# EasyEDA Pro project 无线LED.eprj

# Schematic Schematic1
Create Date: 2023-08-18; Page Name: P1; Project Name: 无线LED; Schematic Name: Schematic1; Update Date: 2023-08-18; Company: 嘉立创EDA; Page Size: A4; Version: V1.0
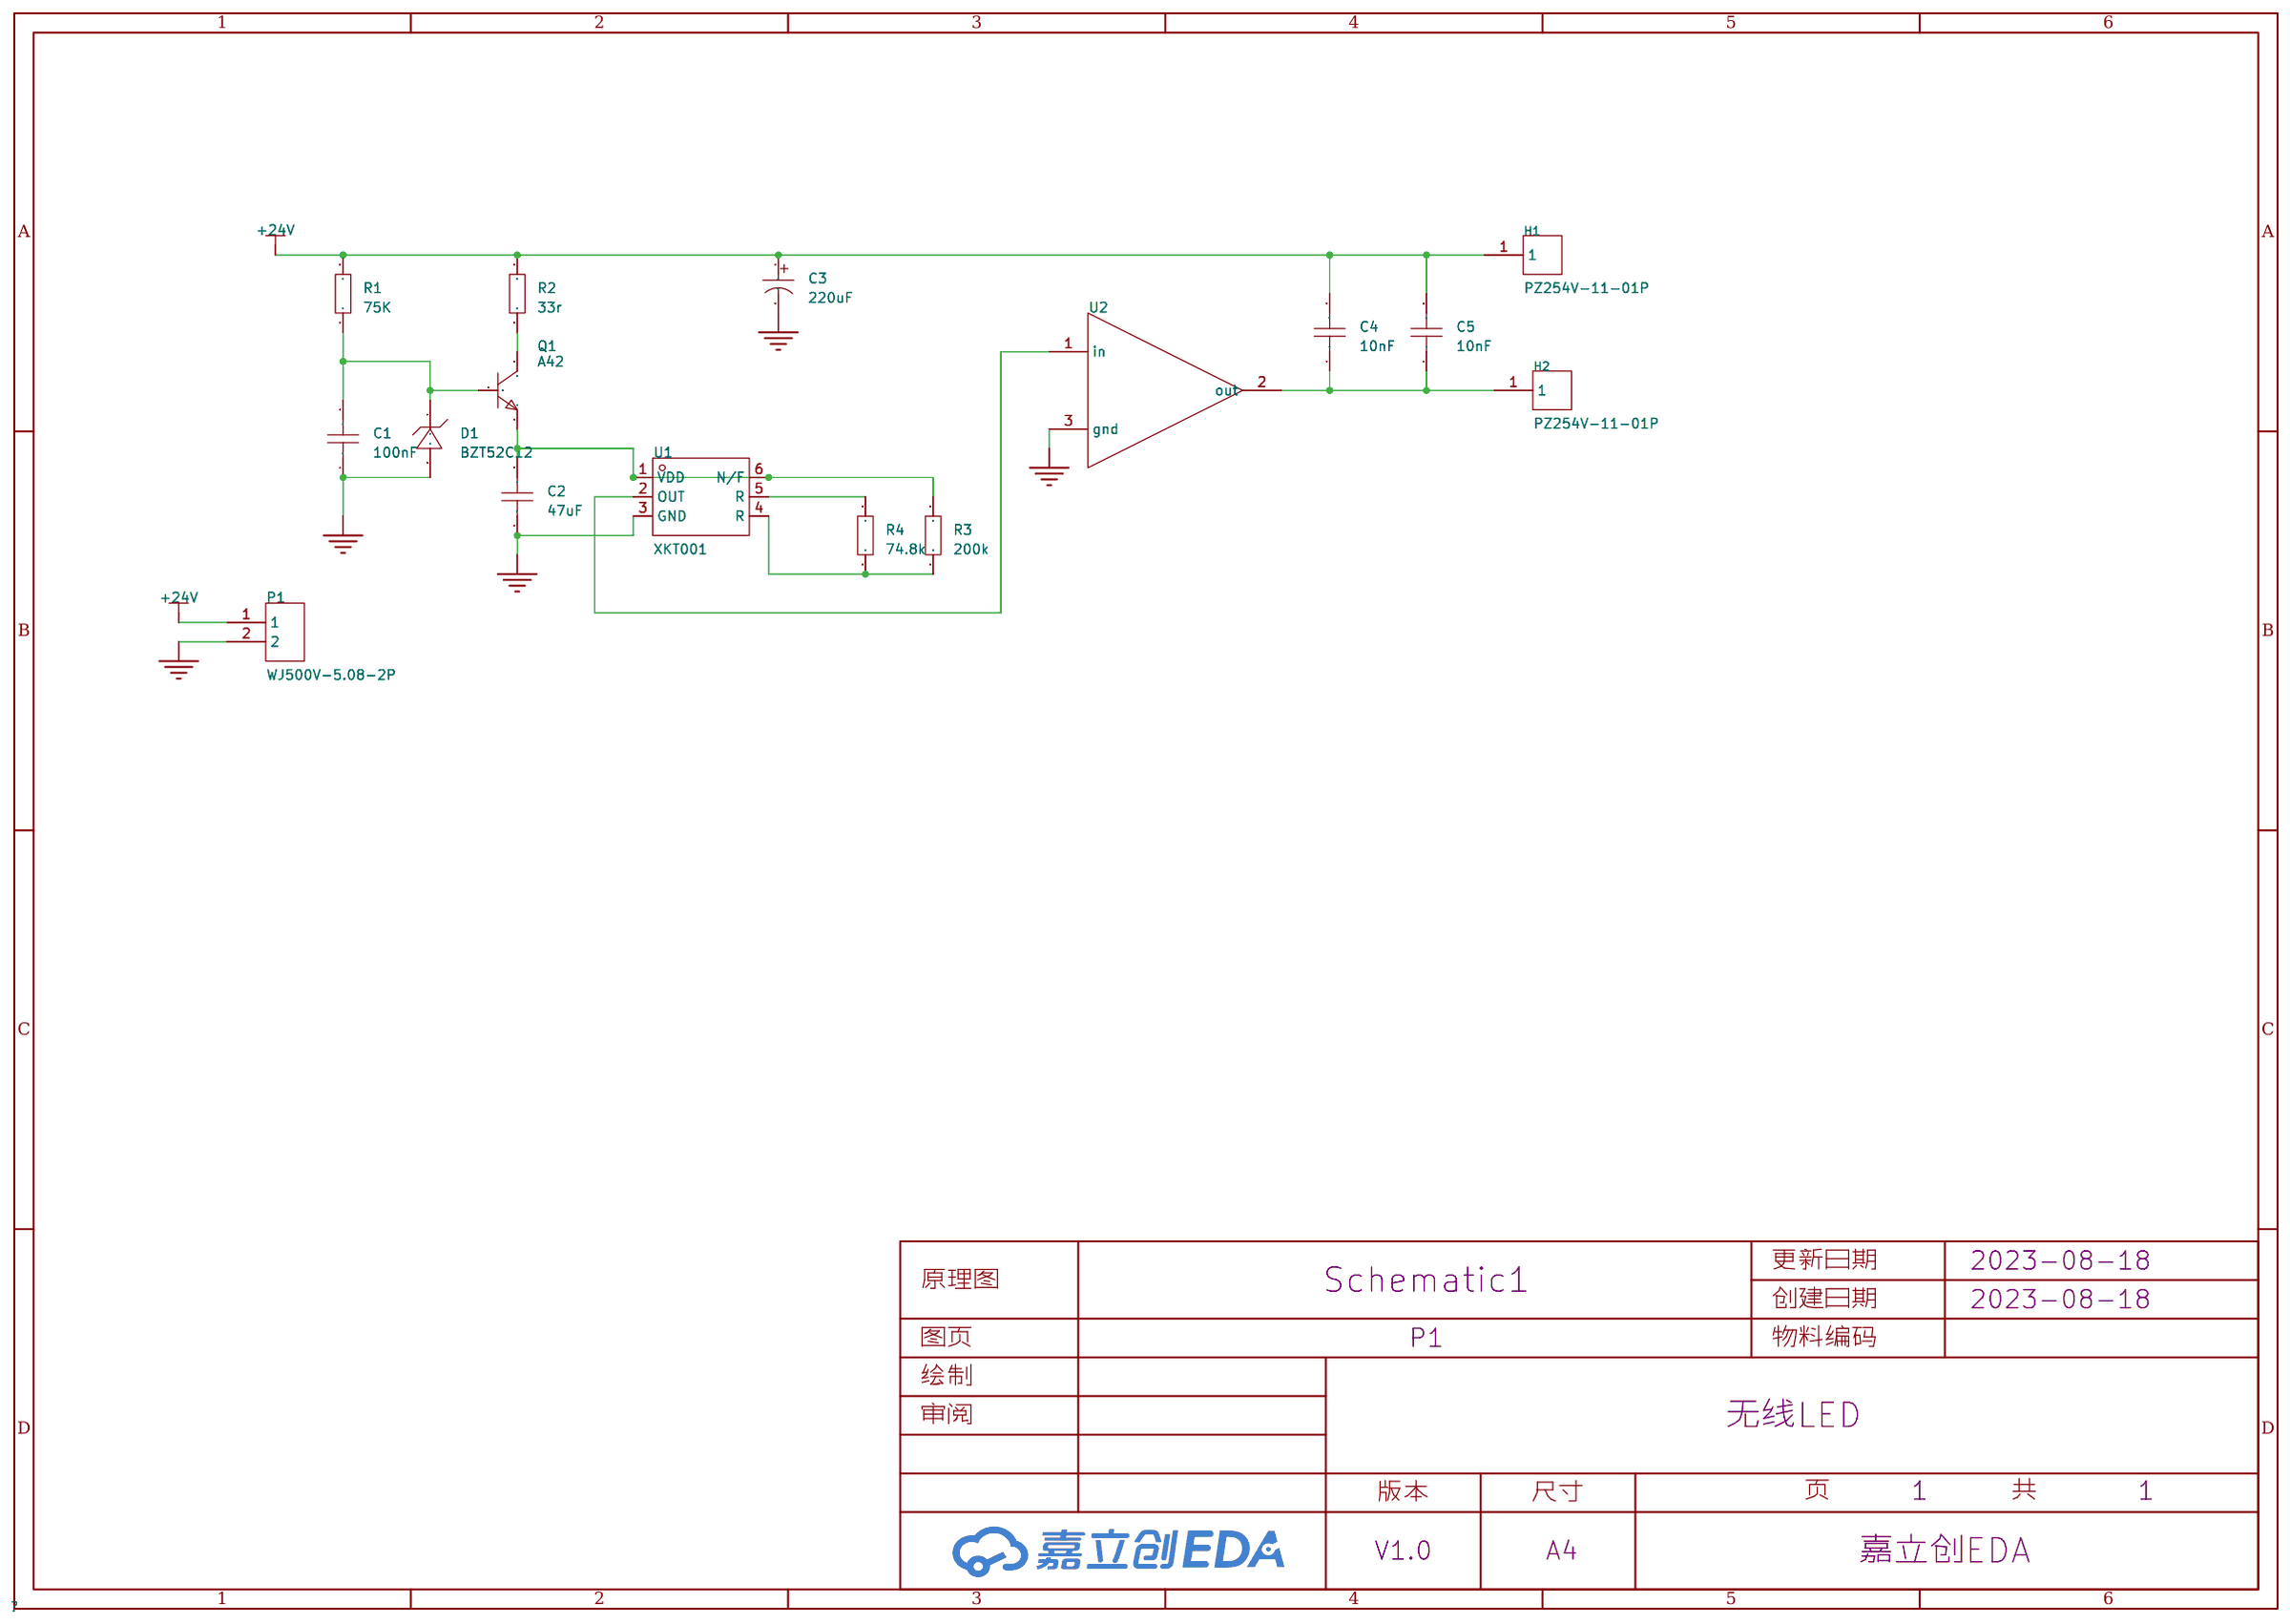
[diagram p0: schematic sheet]

## Parts
C1  100nF  [C0603]
C2  47uF  [C1210]
C3  220uF  [CAP-TH_BD8.0-P3.50-D0.6-FD]
C4  10nF  [C1210]
C5  10nF  [C1210]
D1  BZT52C12  [SOD-123_L2.7-W1.6-LS3.7-RD]
H1  PZ254V-11-01P  [HDR-TH_1P-P2.54-V-M]
H2  PZ254V-11-01P  [HDR-TH_1P-P2.54-V-M]
P1  WJ500V-5.08-2P  [CONN-TH_2P-P5.00_WJ500V-5.08-2P]
Q1  A42  [SOT-89-3_L4.5-W2.5-P1.50-LS4.2-BR]
R1  75K  [R0805]
R2  33r  [R0805]
R3  200k  [R0603]
R4  74.8k  [R0603]
U1  XKT001  [SOT-23-6_L2.9-W1.6-P0.95-LS2.8-BL]
U2  -  [PG-TO220-3_L10.0-W4.5-P2.54-L]

## Library data of the parts
C1 = CAP_0603: Supplier Footprint: 0603
C2 = GRM32ER61C476KE15L: 容值:47uF;精度:±10%;额定电压:16V;材质(温度系数):X5R;; LCSC Part Name: 47uF ±10% 16V; Supplier Part: C77101; Manufacturer: muRata(村田); Supplier Footprint: 1210; JLCPCB Part Class: 扩展库; Datasheet: https://atta.szlcsc.com/upload/public/pdf/source/20221202/FF58125DCA7AB78AED268D88B743009A.pdf; Supplier: LCSC; Tolerance: ±10%; Voltage Rated: 16V; Temperature Coefficient: X5R
C3 = KM227M035F12RR0VH2FP0: 容值:220uF;精度:±20%;额定电压:35V;纹波电流:-;等效串联电阻:-;; LCSC Part Name: 220uF ±20% 35V; Supplier Part: C2063; Manufacturer: CX(承兴); Supplier Footprint: 插件,D8xL12mm; JLCPCB Part Class: Extended Part; Datasheet: https://atta.szlcsc.com/upload/public/pdf/source/20211027/06D6BA3719C264B639DC286D935D03EA.pdf; Supplier: LCSC; Tolerance: ±20%; Rated Voltage: 35V; φD: 8mm; L: 12mm; Lead Spacing: 3.5mm; Lifetime @ Temp: 2000hrs@105℃
C4 C5 = FM32N103J251EFG: 容值:10nF;精度:±5%;额定电压:250V;材质(温度系数):NP0;; LCSC Part Name: 10nF ±5% 250V; Supplier Part: C692309; Manufacturer: PSA(信昌电陶); Supplier Footprint: 1210; JLCPCB Part Class: Extended Part; Datasheet: https://atta.szlcsc.com/upload/public/pdf/source/20191129/C464973_650D2E1C0337226551311C911F3C07C2.pdf; Supplier: LCSC; Tolerance: ±5%; Voltage Rated: 250V; Temperature Coefficient: NP0
D1 = BZT52C12_C173429: 二极管配置:独立式;稳压值(标称值):12V;稳压值(范围):11.4V~12.7V;精度:-;功率:500mW;; LCSC Part Name: 500mW 12V 稳压二极管 5%; Supplier Part: C173429; Manufacturer: MDD; Supplier Footprint: SOD-123; JLCPCB Part Class: 扩展库; Datasheet: https://atta.szlcsc.com/upload/public/pdf/source/20190118/C364303_B79676A2F6BCDB14D56544F3D9B288EE.pdf; Supplier: LCSC; Diode Configuration: 独立式; Zener Voltage (Nom): 12V; Zener Voltage (Range): 11.4V~12.7V; Power Dissipation: 500mW; Reverse Leakage Current (Ir): 100nA@8V; Zener Impedance (Zzt): 25Ω
H1 H2 = PZ254V-11-01P: 排数:单排;总PIN位数:1P;间距:2.54mm;插针结构:1x1P;行距:-;安装类型:直插;圆针/方针:方针;额定电流:-;额定电压:-;配合针长度:6mm;塑高:2.5mm;端接针长度:3mm;触头材质:黄铜;触头镀层:-;工作温度范围:-40℃~+105℃;颜色:黑色;; LCSC Part Name: 2.54mm 1x1P 直插 方针; Supplier Part: C492400; Manufacturer: XFCN(兴飞); Supplier Footprint: 插件,P=2.54mm; JLCPCB Part Class: Extended Part; Datasheet: https://atta.szlcsc.com/upload/public/pdf/source/20200309/C492400_46876A5B545F5AE6B8D4A09C46E276E8.pdf; Supplier: LCSC; Number of Rows: 单排; Number of Pins: 1P; Pitch: 2.54mm; Pin Structure: 1x1P; Mounting Type: 直插; Circluar Pins/Square Pins: 方针; Length of Mating Pin: 6mm; Insulation Height: 2.5mm; Length of End Connection Pin: 3mm; Contact Material: 黄铜; Operating Temperature Range: -40℃~+105℃; Color: 黑色
P1 = WJ500V-5.08-2P: 间距:5.08mm;结构:1x2P;排数:1;每排PIN数:2;安装方式:直针;额定电流:18A;额定电压:250V;线规 - AWG:14~30;线规 - mm2:2.5;工作温度范围:-40℃~+105℃;颜色:绿色;; LCSC Part Name: 5.08mm 1x2P 排数:1 每排P数:2 直针 可拼接; Supplier Part: C8465; Manufacturer: KANGNEX(康奈克斯电气); Supplier Footprint: 插件,P=5.08mm; JLCPCB Part Class: 扩展库; Datasheet: https://atta.szlcsc.com/upload/public/pdf/source/20191225/C8465_02D34CE5B5B4A53DF5891601D97FA9F4.pdf; Supplier: LCSC; Pitch: 5.08mm; Structure: 1x2P; Number of Rows: 1; Number of PINs Per Row: 2; Mounting Style: 直针; Current Rating (Max): 18A; Voltage Rating (Max): 250V; Wire Gauge - AWG: 14~30; Wire Gauge - mm2: 2.5; Operating Temperature Range: -40℃~+105℃; Color: 绿色
Q1 = A42_C779730: 晶体管类型:NPN;集射极击穿电压(Vceo):305V;集电极电流(Ic):200mA;功率(Pd):500mW;集电极截止电流(Icbo):250nA;集电极-发射极饱和电压(VCE(sat)@Ic,Ib):200mV@20mA,2mA;直流电流增益(hFE@Ic,Vce):100@10mA,10V;特征频率(fT):50MHz;工作温度:+150℃@(Tj);; LCSC Part Name: NPN 305V 200mA; Supplier Part: C779730; Manufacturer: ZRE(治润); Supplier Footprint: SOT-89-3L; JLCPCB Part Class: 扩展库; Datasheet: https://atta.szlcsc.com/upload/public/pdf/source/20201109/C779730_DE541665E35BAF24DA8B2BDB9407D5B8.pdf; Supplier: LCSC; Transistor Type: NPN; Collector-Emitter Breakdown Voltage (Vceo): 305V; Collector Current (Ic): 200mA; Power Dissipation (Pd): 500mW; Collector Cut-Off Current (Icbo): 250nA; Collector-Emitter Saturation Voltage (VCE(sat)@Ic,Ib): 200mV@20mA,2mA; DC Current Gain (hFE@Ic,Vce): 100@10mA,10V; Transition Frequency (fT): 50MHz; Operating Temperature: +150℃@(Tj)
R1 R2 = Res_0805: Supplier Footprint: 0805
R3 R4 = Res_0603: Supplier Footprint: 0603
U1 = XKT001: Supplier Part: C2887876; JLCPCB Part Class: 扩展库; Datasheet: 2021-08-18/208488S/0dc1864a123a4df987d8c23323fe9119/XKT001规格书.pdf; Supplier: LCSC
U2 = XKT1511

## Nets
+24V: C3.1 C4.2 C5.2 H1.1 P1.1 R1.2 R2.2
GND: C1.1 C2.1 C3.2 D1.2(A) P1.2 U1.3(GND) U2.3(gnd)
$1N590: C1.2 D1.1(K) Q1.1(B) R1.1
$1N608: Q1.2(C) R2.1
$1N828: R4.2 U1.5(R)
$1N831: R3.1 R4.1 U1.4(R)
$1N840: C2.2 Q1.3(E) R3.2 U1.1(VDD) U1.6(N/F)
$1N931: U1.2(OUT) U2.1(in)
$1N1252: C4.1 C5.1 H2.1 U2.2(out)

# Board PCB1
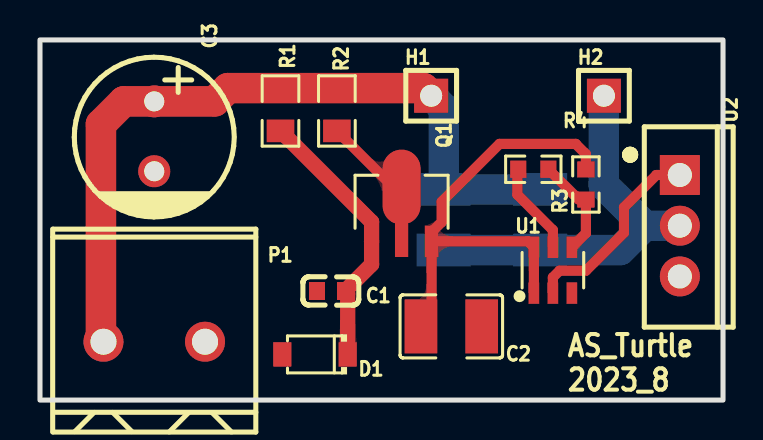
[diagram p1: board, top side]
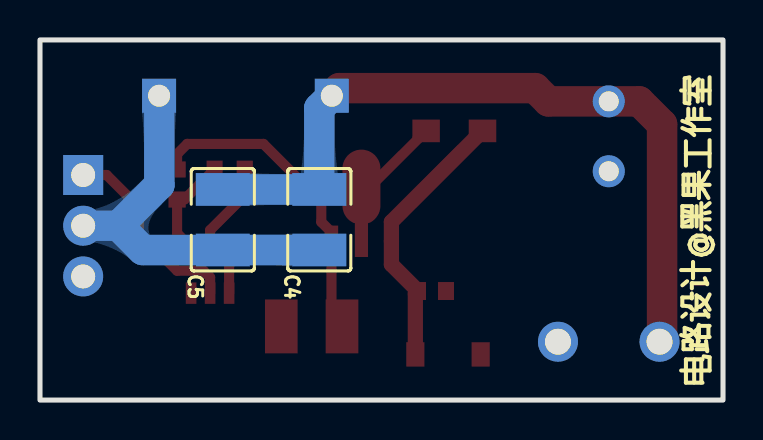
[diagram p2: board, bottom side, seen from below]

Outline 34.16 x 18.03 mm; copper layers: Top Layer, Bottom Layer. Coordinates in mm from the lower left corner of the outline.
Outline path: rectangle 0,18.03 34.16,0
Stack: Top Layer 0.035mm / Dielectric1 1.51mm FR4 er 4.5 / Bottom Layer 0.035mm

## Design rules (mm)
template: 自定义配置
spacing copperThickness1oz (default): track to track 0.102, other pairs 0.152 to 0.3
spacing copperThickness2oz: track to track 0.203, other pairs 0.152 to 0.3
track width copperThickness1oz (default): min 0.127, default 0.254, max 2.54
track width copperThickness2oz: min 0.203, default 0.254, max 2.54
differential pair differentialPair (default): width min 0.127, default 0.254, max 2.54; gap min 0.152, default 0.152
via viaSize (default): diameter min 0.5, default 0.61, max 10; hole min 0.3, default 0.305, max 6.3
net GND uses GND

## Placement (name value [footprint] x y rotation side)
C1  100nF  [C0603]  14.56 5.46 0 top
C2  47uF  [C1210]  20.57 3.69 180 top
C3  220uF  [CAP-TH_BD8.0-P3.50-D0.6-FD]  5.72 13.21 270 top
C4  10nF  [C1210]  20.19 9.03 90 bottom
C5  10nF  [C1210]  25.02 9.03 90 bottom
D1  BZT52C12  [SOD-123_L2.7-W1.6-LS3.7-RD]  13.75 2.29 180 top
H1  PZ254V-11-01P  [HDR-TH_1P-P2.54-V-M]  19.57 15.24 0 top
H2  PZ254V-11-01P  [HDR-TH_1P-P2.54-V-M]  28.21 15.24 0 top
P1  WJ500V-5.08-2P  [CONN-TH_2P-P5.00_WJ500V-5.08-2P]  5.72 2.92 0 top
Q1  A42  [SOT-89-3_L4.5-W2.5-P1.50-LS4.2-BR]  18.09 9.31 270 top
R1  75K  [R0805]  12.03 14.48 90 top
R2  33r  [R0805]  14.85 14.48 90 top
R3  200k  [R0603]  27.31 10.8 90 top
R4  74.8k  [R0603]  24.68 11.56 180 top
U1  XKT001  [SOT-23-6_L2.9-W1.6-P0.95-LS2.8-BL]  25.65 6.5 0 top
U2  -  [PG-TO220-3_L10.0-W4.5-P2.54-L]  32 8.73 270 top

## Footprints (pads in the part's own frame, mm; a bottom-side part is the same pattern mirrored in y, then rotated)
C0603
  rect 0.8x0.9 smd: 1(-0.7,0) 2(0.7,0)
C1210
  rect 1.635x2.7 smd: 1(-1.518,0) 2(1.518,0)
CAP-TH_BD8.0-P3.50-D0.6-FD
  round 1.6 hole 1: 1(-1.75,0) 2(1.75,0)
CONN-TH_2P-P5.00_WJ500V-5.08-2P
  round 2 hole 1.3: 1(-2.54,0) 2(2.54,0)
HDR-TH_1P-P2.54-V-M
  rect 1.7x1.7 hole 1.1: 1(0,0)
PG-TO220-3_L10.0-W4.5-P2.54-L
  rect 2x2 hole 1.2: 1(-2.54,0)
  round 2 hole 1.2: 2(0,0) 3(2.54,0)
R0603
  rect 0.806x0.864 smd: 1(-0.753,0) 2(0.753,0)
R0805
  rect 1.133x1.377 smd: 1(-1,0) 2(1,0)
SOD-123_L2.7-W1.6-LS3.7-RD
  rect 0.91x1.22 smd: 1(-1.635,0) 2(1.635,0)
SOT-23-6_L2.9-W1.6-P0.95-LS2.8-BL
  rect 0.532x1.072 smd: 1(-0.95,-1.149) 2(0,-1.149) 3(0.95,-1.149) 4(0.95,1.149) 5(0,1.149) 6(-0.95,1.149)
SOT-89-3_L4.5-W2.5-P1.50-LS4.2-BR
  rect 1.575x0.672 smd: 1(1.356,-1.5) 3(1.356,1.5)
  custom 5.377x1.9 smd: 2(-1.356,0)

## Nets
As in the schematic.

## Routing (per net, layer and track width the routed paths; a pad name or vN(x,y) marks a point on that pad's centre or on a via; arc(x,y) is an arc through that point)
+24V: length 38.1
  Top Layer w1.524: H1.1 19.19,15.62 9.4,15.62 8.74,14.96 C3.1 4.19,14.96 3.05,13.81 3.05,3.05 P1.1
  Bottom Layer w1.524: C5.2 C4.2 20.19,14.61 H1.1
$1N590: length 13.7
  Top Layer w0.762: D1.1 15.39,5.33 C1.2 16.59,6.79 16.59,8.92 R1.1
$1N608: length 4.4
  Top Layer w0.508: Q1.2 17.67,10.66 R2.1
$1N828: length 4.7
  Top Layer w0.508: U1.5 25.65,8.51 23.88,10.29 23.88,11.51 R4.2
$1N831: length 5.2
  Top Layer w0.508: R4.1 26.94,10.04 R3.1 27.31,8.35 U1.4
$1N840: length 23.6
  Top Layer w0.508: 19.59,7.95 24.41,7.95 U1.6 U1.1 ; 19.59,7.95 19.59,8.41 20.09,8.92 20.09,9.93 22.99,12.83 26.8,12.83 27.31,12.32 R3.2 ; 19.59,7.95 19.59,4.22 C2.2
$1N931: length 10
  Top Layer w0.508: U1.2 25.65,6.15 25.99,6.48 27.31,6.48 29.21,8.38 29.21,9.65 30.83,11.27 U2.1
$1N1252: length 19.7
  Bottom Layer w1.524: 30.24,8.73 29.02,7.51 20.19,7.51 ; 30.24,8.73 U2.2 ; 30.24,8.73 28.19,10.78 28.19,15.23 H2.1

## Copper pours and planes (outline as drawn; the poured copper is in the pictures)
GND on Top Layer: 0,18.03 34.16,18.03 34.16,0 0,0
GND on Bottom Layer: 0,18.03 34.16,18.03 34.16,0 0,0

Small or netless copper shapes (teardrops, artwork), in the pictures only: 11 on Top Layer, 9 on Bottom Layer

## Text on the board
Bottom Silkscreen Layer: 电路设计@黑果工作室
Top Silkscreen Layer: AS_Turtle / 2023_8
